# Altium schematic sheet EC-Remoter.SchDoc
size A4; SheetNumber: 1; SheetTotal: 1
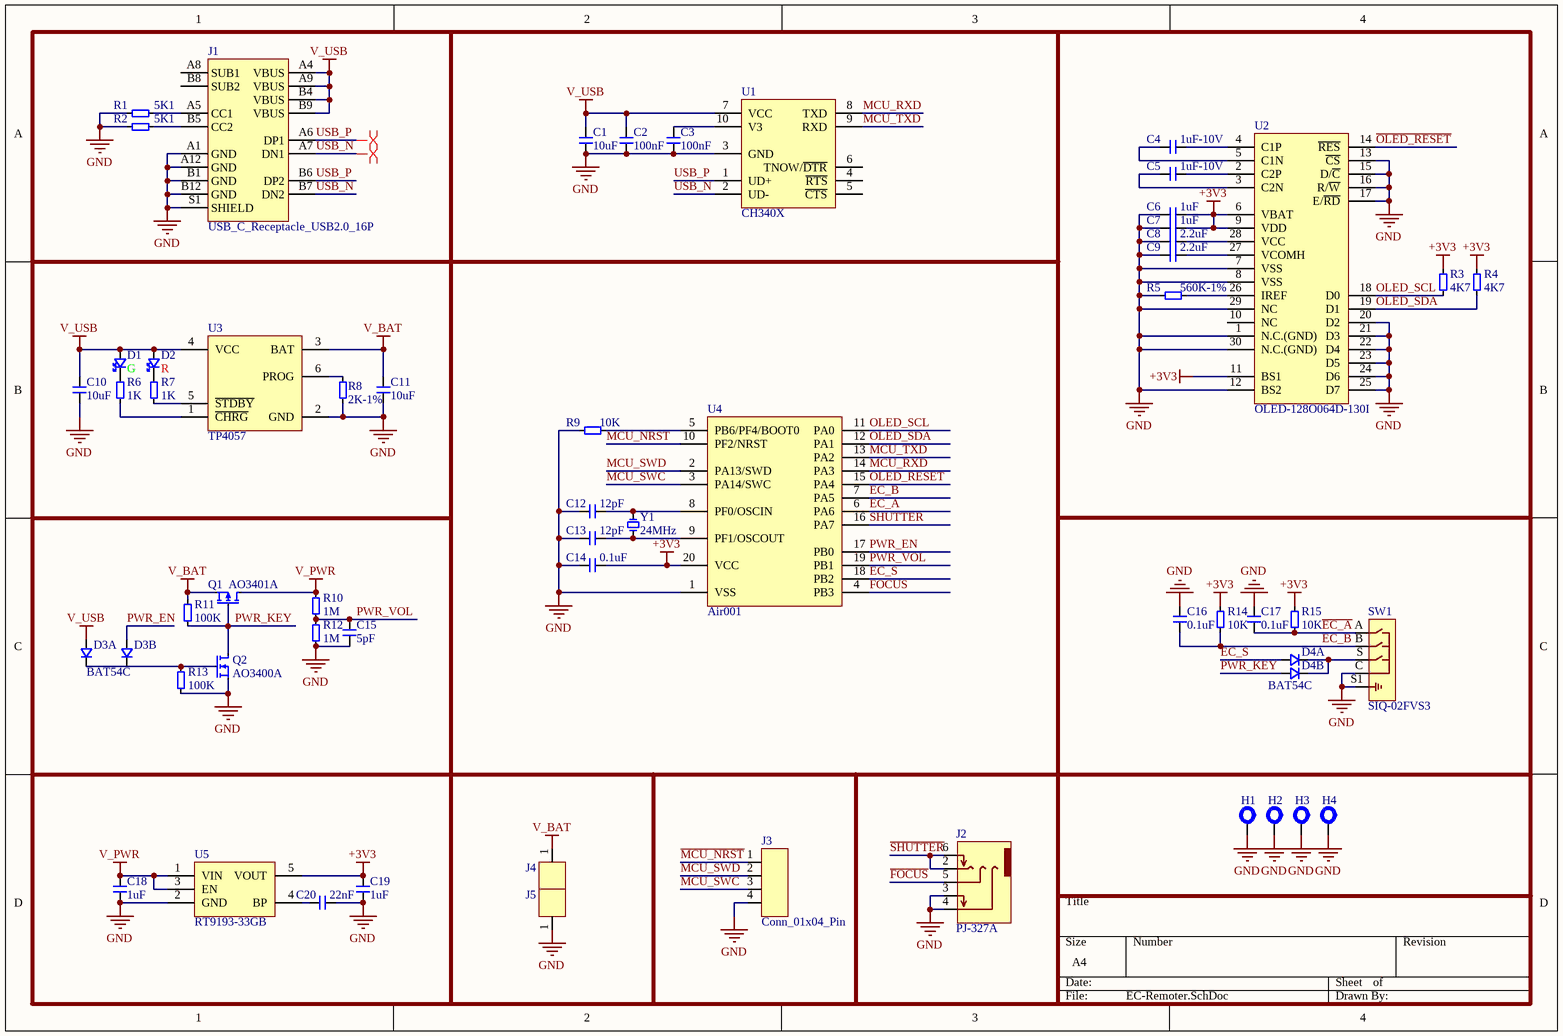
[diagram p0: EC-Remoter.SchDoc]

## Parts
C1  10uF  [C_0402_1005Metric]
C2  100nF  [C_0402_1005Metric]
C3  100nF  [C_0402_1005Metric]
C4  1uF-10V  [C_0402_1005Metric]
C5  1uF-10V  [C_0402_1005Metric]
C6  1uF  [C_0402_1005Metric]
C7  1uF  [C_0402_1005Metric]
C8  2.2uF  [C_0402_1005Metric]
C9  2.2uF  [C_0402_1005Metric]
C10  10uF  [C_0402_1005Metric]
C11  10uF  [C_0402_1005Metric]
C12  12pF  [C_0402_1005Metric]
C13  12pF  [C_0402_1005Metric]
C14  0.1uF  [C_0402_1005Metric]
C15  5pF  [C_0402_1005Metric]
C16  0.1uF  [C_0402_1005Metric]
C17  0.1uF  [C_0402_1005Metric]
C18  1uF  [C_0402_1005Metric]
C19  1uF  [C_0402_1005Metric]
C20  22nF  [C_0402_1005Metric]
D1  G  [LED_0603_1608Metric]
D2  R  [LED_0603_1608Metric]
D3  BAT54C  [SOT-23-3]  (parts A,B of 2)
D4  BAT54C  [SOT-23-3]  (parts A,B of 2)
H1  MountingHole_Pad  [MountingHole_2.2mm_M2_Pad_Via]  (value not drawn)
H2  MountingHole_Pad  [MountingHole_2.2mm_M2_Pad_Via]  (value not drawn)
H3  MountingHole_Pad  [MountingHole_2.2mm_M2_Pad_Via]  (value not drawn)
H4  MountingHole_Pad  [MountingHole_2.2mm_M2_Pad_Via]  (value not drawn)
J1  USB_C_Receptacle_USB2.0_16P  [USB_C_Receptacle_GCT_USB4105-xx-A_16P_TopMnt_Horizontal]
J2  PJ-327A  [Jack_3.5mm_PJ327A_Horizontal]
J3  Conn_01x04_Pin  [PinHeader_1x04_P2.54mm_Vertical]
J4  Conn_01x01_Pin  [TestPoint_Plated_Hole_D1.0mm]  (value not drawn)
J5  Conn_01x01_Pin  [TestPoint_Plated_Hole_D1.0mm]  (value not drawn)
Q1  AO3401A  [SOT-23-3]
Q2  AO3400A  [SOT-23-3]
R1  5K1  [R_0402_1005Metric]
R2  5K1  [R_0402_1005Metric]
R3  4K7  [R_0402_1005Metric]
R4  4K7  [R_0402_1005Metric]
R5  560K-1%  [R_0402_1005Metric]
R6  1K  [R_0402_1005Metric]
R7  1K  [R_0402_1005Metric]
R8  2K-1%  [R_0402_1005Metric]
R9  10K  [R_0402_1005Metric]
R10  1M  [R_0402_1005Metric]
R11  100K  [R_0402_1005Metric]
R12  1M  [R_0402_1005Metric]
R13  100K  [R_0402_1005Metric]
R14  10K  [R_0402_1005Metric]
R15  10K  [R_0402_1005Metric]
SW1  SIQ-02FVS3  [SIQ-02FVS3]
U1  CH340X  [MSOP-10_3x3mm_P0.5mm]
U2  OLED-128O064D-130I  [OLED-128O064D]
U3  TP4057  [SOT-23-6]
U4  Air001  [TSSOP-20_4.4x6.5mm_P0.65mm]
U5  RT9193-33GB  [SOT-23-5]
Y1  24MHz  [Crystal_SMD_3225-4Pin_3.2x2.5mm]

## Nets
+3V3: C6.2 C7.2 C14.2 C19.1 R3.1 R4.1 R14.2 R15.2 U2.6(VBAT) U2.9(VDD) U2.11(BS1) U4.20(VCC) U5.5(VOUT)
GND: C1.2 C2.2 C3.2 C6.1 C7.1 C8.1 C9.1 C10.2 C11.2 C12.1 C13.1 C14.1 C15.2 C16.2 C17.2 C18.2 C19.2 C20.2 H1.1 H2.1 H3.1 H4.1 J1.A1(GND) J1.A12(GND) J1.B1(GND) J1.B12(GND) J1.S1(SHIELD) J2.3 J2.4 J3.4 J4.1 Q2.2(S) R1.1 R2.1 R5.1 R8.2 R9.1 R12.2 R13.2 SW1.C SW1.S1(SHIELD) U1.3(GND) U2.1(N.C.(GND)) U2.7(VSS) U2.8(VSS) U2.12(BS2) U2.13(~{CS}) U2.15(D/~{C}) U2.16(R/~{W}) U2.17(E/~{RD}) U2.20(D2) U2.21(D3) U2.22(D4) U2.23(D5) U2.24(D6) U2.25(D7) U2.29(NC) U2.30(N.C.(GND)) U3.2(GND) U4.1(VSS) U5.2(GND)
V_BAT: C11.1 J5.1 Q1.2(S) R11.2 U3.3(BAT)
V_PWR: C18.1 Q1.3(D) R10.1 U5.1(VIN) U5.3(EN)
V_USB: C1.1 C2.1 C10.1 D1.2(A) D2.2(A) D3.1 J1.A4(VBUS) J1.A9(VBUS) J1.B4(VBUS) J1.B9(VBUS) U1.7(VCC) U3.4(VCC)
~{EC_A}: C17.1 R15.1 SW1.A U4.6(PA6)
~{EC_B}: C16.1 R14.1 SW1.B U4.7(PA5)
~{EC_S}: D4.1 U4.18(PB2)
~{FOCUS}: J2.5 U4.4(PB3)
~{MCU_NRST}: J3.1 U4.10(PF2/NRST)
MCU_RXD: U1.8(TXD) U4.14(PA3)
MCU_SWC: J3.3 U4.3(PA14/SWC)
MCU_SWD: J3.2 U4.2(PA13/SWD)
MCU_TXD: U1.9(RXD) U4.13(PA2)
~{OLED_RESET}: U2.14(~{RES}) U4.15(PA4)
OLED_SCL: R3.2 U2.18(D0) U4.11(PA0)
OLED_SDA: R4.2 U2.19(D1) U4.12(PA1)
PWR_EN: D3.2 U4.17(PB0)
PWR_KEY: D4.2 Q1.1(G) Q2.3(D) R11.1
PWR_VOL: C15.1 R10.2 R12.1 U4.19(PB1)
~{SHUTTER}: J2.2 J2.6 U4.16(PA7)
USB_N: J1.A7(DN1) J1.B7(DN2) U1.2(UD-)
USB_P: J1.A6(DP1) J1.B6(DP2) U1.1(UD+)
NetC3_1: C3.1 U1.10(V3)
NetC4_1: C4.1 U2.5(C1N)
NetC4_2: C4.2 U2.4(C1P)
NetC5_1: C5.1 U2.3(C2N)
NetC5_2: C5.2 U2.2(C2P)
NetC8_2: C8.2 U2.28(VCC)
NetC9_2: C9.2 U2.27(VCOMH)
NetC12_2: C12.2 U4.8(PF0/OSCIN) Y1.1
NetC13_2: C13.2 U4.9(PF1/OSCOUT) Y1.2
NetC20_1: C20.1 U5.4(BP)
NetD1_1: D1.1(K) R6.1
NetD2_1: D2.1(K) R7.1
NetD3_3: D3.3 Q2.1(G) R13.1
NetD4_3: D4.3 SW1.S
NetJ1_A5: J1.A5(CC1) R1.2
NetJ1_B5: J1.B5(CC2) R2.2
NetR5_2: R5.2 U2.26(IREF)
NetR6_2: R6.2 U3.1(~{CHRG})
NetR7_2: R7.2 U3.5(~{STDBY})
NetR8_1: R8.1 U3.6(PROG)
NetR9_2: R9.2 U4.5(PB6/PF4/BOOT0)

Not connected (* = marked no-connect by the designer): J1 A8(SUB1) B8(SUB2); U1 4(~{RTS}) 5(~{CTS}) 6(TNOW/~{DTR}); U2 10(NC)

## Layout directives
differential pair: USB_N, USB_P

## Library data of the parts
C1-C20 = C: Capacitor
D1 D2 = LED: Light emitting diode
D3 D4 = BAT54C: dual schottky barrier diode, common cathode
H1-H4 = MountingHole_Pad: Mounting Hole with connection
J1 = USB_C_Receptacle_USB2.0_16P: USB 2.0-only 16P Type-C Receptacle connector
J3 = Conn_01x04_Pin: Generic connector, single row, 01x04
J4 J5 = Conn_01x01_Pin: Generic connector, single row, 01x01
Q1 = AO3401A: Package_TO_SOT_SMD:SOT-23
Q2 = AO3400A: 30V Vds, 5.7A Id, N-Channel MOSFET, SOT-23
R1-R15 = R: Resistor
U1 = CH340X: USB serial converter, 5V-tolerant IO, UART, MSOP-10
U2 = OLED-128O064D-130I: 1.30' OLED display 128x64
U3 = TP4057: 500mA Single-Cell Li-Ion Charger, SOT-23-6
U4 = Air001: 合宙 Arm Cortex-M0+ MCU, 32KB Flash, 4KB RAM, 48 MHz, 1.7-5.5V, 18 GPIO, TSSOP20
U5 = RT9193: Positive 300mA Low Dropout Regulator
Y1 = Crystal: pin to pad: 2>3